# Altium schematic sheet microcontroller.SchDoc
size B; SheetNumber: 6; SheetTotal: 6
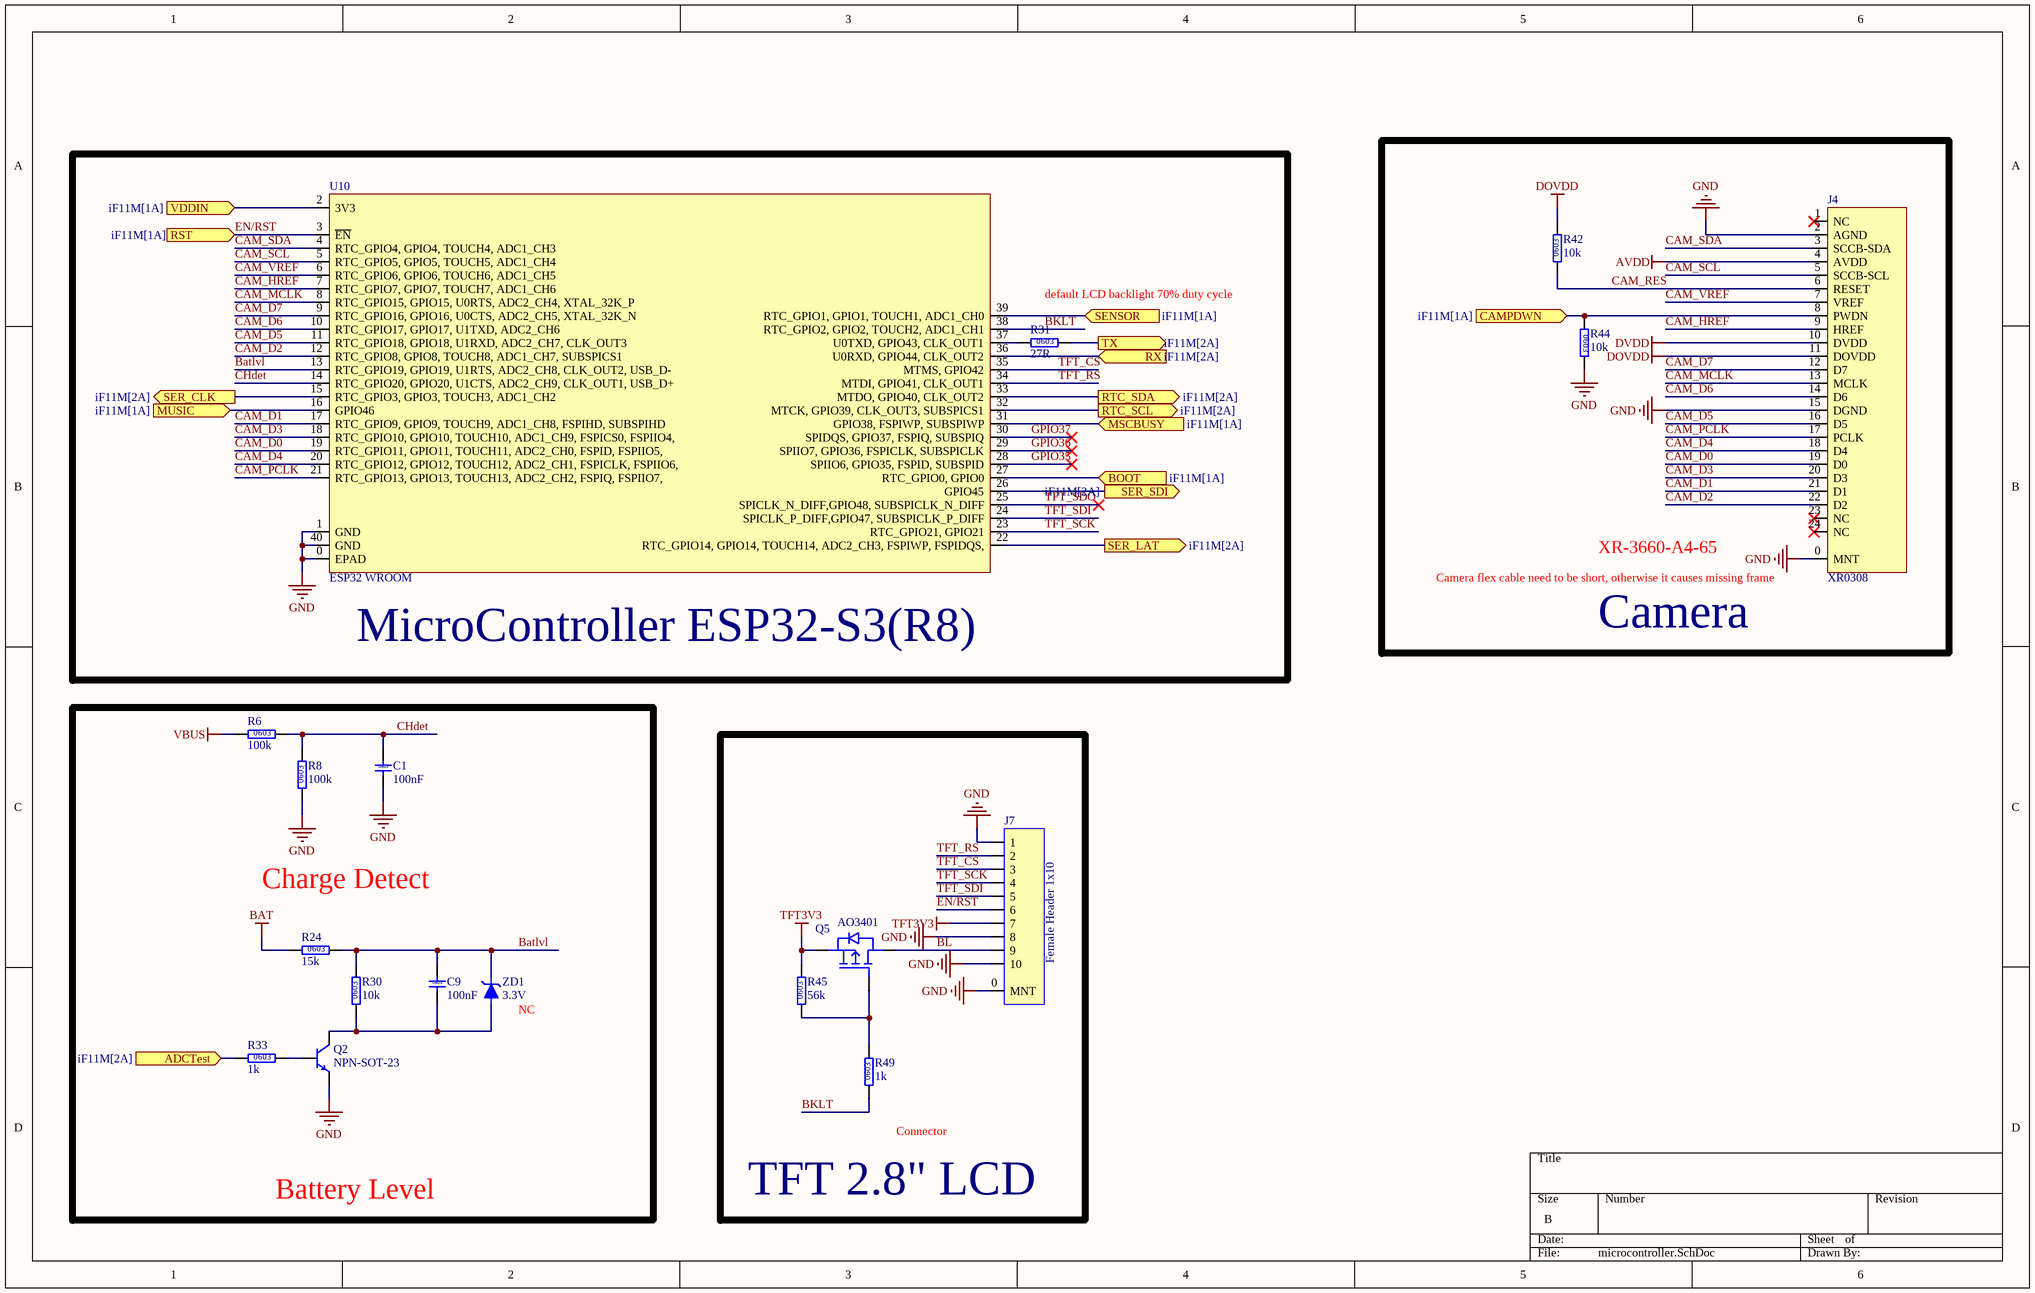
[diagram p0: microcontroller.SchDoc]

## Parts
C1  100nF  [C0603]
C9  100nF  [C0603]
J4  XR0308  [FPC24-0.5P-TOP]
J7  Female Header 1x10  [FPC10-1mm-SMT  BOTTOM]
Q2  NPN-SOT-23  [SOT23]
Q5  AO3401  [PMOS-SOT23]
R6  100k  [R0603-LD]
R8  100k  [R0603-LD]
R24  15k  [R0603-LD]
R30  10k  [R0603-LD]
R31  27R  [R0603-LD]
R33  1k  [R0603-LD]
R42  10k  [R0603-LD]
R44  10k  [R0603-LD]
R45  56k  [R0603-LD]
R49  1k  [R0603-LD]
U10  ESP32 WROOM  [ESP32-S3-WROOM-1]
ZD1  3.3V  [SOD-323]

## Blocks framed on the sheet
MicroController ESP32-S3(R8): R31 U10
Camera: J4 R42 R44
TFT 2.8" LCD: J7 Q5 R45 R49

## Ports
ADCTest (in, see iF11M[2A]), BOOT (in, see iF11M[1A]), CAMPDWN (in, see iF11M[1A]), MSCBUSY (in, see iF11M[1A]), MUSIC (in, see iF11M[1A]), RST (in, see iF11M[1A]), RTC_SCL (out, see iF11M[2A]), RTC_SDA (out, see iF11M[2A]), RX (in, see iF11M[2A]), SENSOR (in, see iF11M[1A]), SER_CLK (out, see iF11M[2A]), SER_LAT (out, see iF11M[2A]), SER_SDI (out, see iF11M[2A]), TX (out, see iF11M[2A]), VDDIN (in, see iF11M[1A])

## Nets
AVDD: J4.4(AVDD)
BAT: R24.1
DOVDD: J4.11(DOVDD) R42.2
DVDD: J4.10(DVDD)
GND: C1.2 J4.0(MNT) J4.2(AGND) J4.15(DGND) J7.0(MNT) J7.1 J7.8 J7.10 Q2.2(E) R8.1 R44.2 U10.0(EPAD) U10.1(GND) U10.40(GND)
TFT3V3: J7.7 Q5.3(S) R45.2
VBUS: R6.1
ADCTest: R33.1 ; port ADCTest
Batlvl: C9.1 R24.2 R30.2 U10.13(RTC_GPIO19,_GPIO19,_U1RTS,_ADC2_CH8,_CLK_OUT2,_USB_D-) ZD1.2(K)
BKLT: R49.1 U10.38(RTC_GPIO2,_GPIO2,_TOUCH2,_ADC1_CH1)
BL: J7.9 Q5.2(D)
BOOT: U10.27(RTC_GPIO0,_GPIO0) ; port BOOT
CAM_D0: J4.19(D0) U10.19(RTC_GPIO11,_GPIO11,_TOUCH11,_ADC2_CH0,_FSPID,_FSPIIO5,)
CAM_D1: J4.21(D1) U10.17(RTC_GPIO9,_GPIO9,_TOUCH9,_ADC1_CH8,_FSPIHD,_SUBSPIHD)
CAM_D2: J4.22(D2) U10.12(RTC_GPIO8,_GPIO8,_TOUCH8,_ADC1_CH7,_SUBSPICS1)
CAM_D3: J4.20(D3) U10.18(RTC_GPIO10,_GPIO10,_TOUCH10,_ADC1_CH9,_FSPICS0,_FSPIIO4,)
CAM_D4: J4.18(D4) U10.20(RTC_GPIO12,_GPIO12,_TOUCH12,_ADC2_CH1,_FSPICLK,_FSPIIO6,)
CAM_D5: J4.16(D5) U10.11(RTC_GPIO18,_GPIO18,_U1RXD,_ADC2_CH7,_CLK_OUT3)
CAM_D6: J4.14(D6) U10.10(RTC_GPIO17,_GPIO17,_U1TXD,_ADC2_CH6)
CAM_D7: J4.12(D7) U10.9(RTC_GPIO16,_GPIO16,_U0CTS,_ADC2_CH5,_XTAL_32K_N)
CAM_HREF: J4.9(HREF) U10.7(RTC_GPIO7,_GPIO7,_TOUCH7,_ADC1_CH6)
CAM_MCLK: J4.13(MCLK) U10.8(RTC_GPIO15,_GPIO15,_U0RTS,_ADC2_CH4,_XTAL_32K_P)
CAM_PCLK: J4.17(PCLK) U10.21(RTC_GPIO13,_GPIO13,_TOUCH13,_ADC2_CH2,_FSPIQ,_FSPIIO7,)
CAM_RES: J4.6(RESET) R42.1
CAM_SCL: J4.5(SCCB-SCL) U10.5(RTC_GPIO5,_GPIO5,_TOUCH5,_ADC1_CH4)
CAM_SDA: J4.3(SCCB-SDA) U10.4(RTC_GPIO4,_GPIO4,_TOUCH4,_ADC1_CH3)
CAM_VREF: J4.7(VREF) U10.6(RTC_GPIO6,_GPIO6,_TOUCH6,_ADC1_CH5)
CAMPDWN: J4.8(PWDN) R44.1 ; port CAMPDWN
CHdet: C1.1 R6.2 R8.2 U10.14(RTC_GPIO20,_GPIO20,_U1CTS,_ADC2_CH9,_CLK_OUT1,_USB_D+)
EN/RST: J7.6 U10.3(~{EN}) ; port RST
GPIO35: U10.28(SPIIO6,_GPIO35,_FSPID,_SUBSPID)
GPIO36: U10.29(SPIIO7,_GPIO36,_FSPICLK,_SUBSPICLK)
GPIO37: U10.30(SPIDQS,_GPIO37,_FSPIQ,_SUBSPIQ)
MSCBUSY: U10.31(GPIO38,_FSPIWP,_SUBSPIWP) ; port MSCBUSY
MUSIC: U10.16(GPIO46) ; port MUSIC
RTC_SCL: U10.32(MTCK,_GPIO39,_CLK_OUT3,_SUBSPICS1) ; port RTC_SCL
RTC_SDA: U10.33(MTDO,_GPIO40,_CLK_OUT2) ; port RTC_SDA
RX: U10.36(U0RXD,_GPIO44,_CLK_OUT2) ; port RX
SENSOR: U10.39(RTC_GPIO1,_GPIO1,_TOUCH1,_ADC1_CH0) ; port SENSOR
SER_CLK: U10.15(RTC_GPIO3,_GPIO3,_TOUCH3,_ADC1_CH2) ; port SER_CLK
SER_LAT: U10.22(RTC_GPIO14,_GPIO14,_TOUCH14,_ADC2_CH3,_FSPIWP,_FSPIDQS,) ; port SER_LAT
SER_SDI: U10.26(GPIO45) ; port SER_SDI
TFT_CS: J7.3 U10.35(MTMS,_GPIO42)
TFT_RS: J7.2 U10.34(MTDI,_GPIO41,_CLK_OUT1)
TFT_SCK: J7.4 U10.23(RTC_GPIO21,_GPIO21)
TFT_SDI: J7.5 U10.24(SPICLK_P_DIFF,GPIO47,_SUBSPICLK_P_DIFF)
TFT_SDO: U10.25(SPICLK_N_DIFF,GPIO48,_SUBSPICLK_N_DIFF)
TX: R31.2 ; port TX
VDDIN: U10.2(3V3) ; port VDDIN
NetC9_2: C9.2 Q2.3(C) R30.1 ZD1.1(A)
NetQ2_1: Q2.1(B) R33.2
NetQ5_1: Q5.1(G) R45.1 R49.2
NetR31_1: R31.1 U10.37(U0TXD,_GPIO43,_CLK_OUT1)

Not connected (* = marked no-connect by the designer): J4 1(NC)* 23(NC)* 24(NC)*

## Notes on the sheet
- default LCD backlight 70% duty cycle
- XR-3660-A4-65
- (near J4) Camera flex cable need to be short, otherwise it causes missing frame
- Charge Detect
- (near ZD1) NC
- (near R49) Connector
- Battery Level
- (in symbol C 0603 100nF 50V) 0603
- (in symbol R 0603 1k) 0603
- (in symbol R 0603 10k) 0603
- (in symbol R 0603 27R) 0603
- (in symbol R 0603 56k) 0603
- (in symbol R 0603 100k) 0603

## Library data of the parts
C1 C9 = C 0603 100nF 50V: 10% 50V; Part No: W-T-CA-X703N100K50VNT; Manufacturer: FENGHUA; Material Name: 贴片电容0603 100NF/50V 10%; Product Code: WP0002721; Supplier: 南京南山半导体有限公司
J4 = XR0308-TOP
J7 = FPC10P-1mm-BOT: 10 Pin FPC BOTTOM Contact
Q5 = MOSFET-P-Channel: Part No: *; Product Code: *; Suppliers: *; Manufacturer: *
R6 R8 R24 R30 = R 0603 100k: 5%; Part No: W-T-RE-RS03K104JT; Manufacturer: LAGEO; Material Name: 贴片电阻0603 100K 5%; Product Code: WP0002713; Supplier: 南京南山半导体有限公司
R31 = R 0603 27R: 5%; Part No: W-T-RE-RS03K270JT; Manufacturer: LAGEO; Material Name: 贴片电阻0603 27Ω 5%; Product Code: WP0002702; Supplier: 南京南山半导体有限公司
R33 R49 = R 0603 1k: 5%; Part No: W-T-RE-RS03K102JT; Manufacturer: LAGEO; Material Name: 贴片电阻0603 1K  5%; Product Code: WP0002703; Supplier: 南京南山半导体有限公司
R42 R44 = R 0603 10k: 5%; Part No: W-T-RE-RS03K103JT; Manufacturer: 热敏D541V11增加1颗用量; Material Name: 贴片电阻0603 10K 5%; Product Code: WP0002708; Supplier: 南京南山半导体有限公司
R45 = R 0603 56k: 5%; Part No: W-T-RE-RS03K563JT; Manufacturer: LAGEO; Material Name: 贴片电阻0603 56K 5%; Product Code: WP0002712; Supplier: 南京南山半导体有限公司
U10 = ESP32-S3-WROOM-1
ZD1 = Zener Diode: Zener Diode 300mW